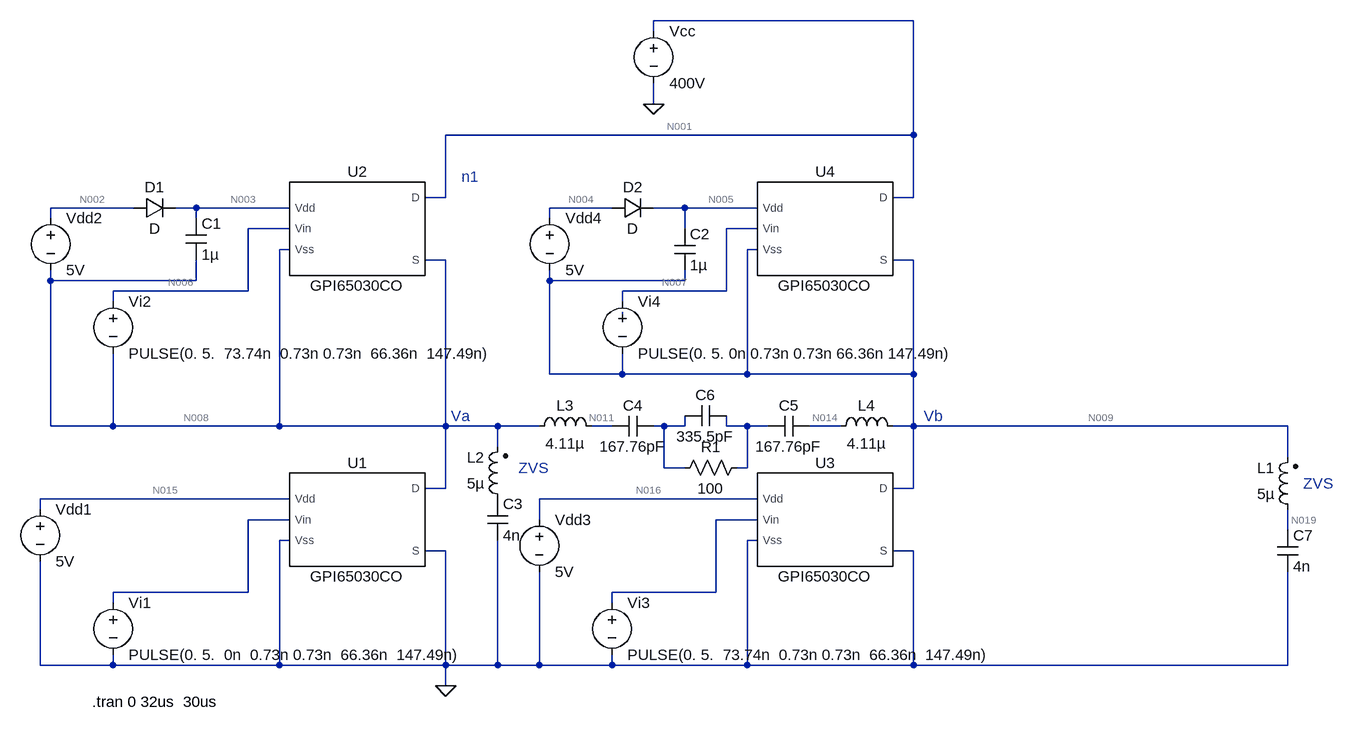
[diagram p0: schematic PowerFull.asc]
PowerFull.asc, the LTspice schematic file:
Version 4
SHEET 1 1984 680
WIRE 768 -608 368 -608
WIRE 368 -592 368 -608
WIRE 368 -480 368 -512
WIRE 768 -432 768 -608
WIRE 768 -432 48 -432
WIRE 48 -336 48 -432
WIRE 48 -336 16 -336
WIRE 768 -336 768 -432
WIRE 768 -336 736 -336
WIRE -432 -320 -560 -320
WIRE -336 -320 -368 -320
WIRE -192 -320 -336 -320
WIRE 304 -320 208 -320
WIRE 416 -320 368 -320
WIRE 528 -320 416 -320
WIRE -560 -304 -560 -320
WIRE -336 -304 -336 -320
WIRE 208 -304 208 -320
WIRE -192 -288 -256 -288
WIRE 416 -288 416 -320
WIRE 528 -288 480 -288
WIRE -192 -256 -208 -256
WIRE 528 -256 512 -256
WIRE 48 -240 16 -240
WIRE 768 -240 736 -240
WIRE -560 -208 -560 -224
WIRE -336 -208 -336 -240
WIRE -336 -208 -560 -208
WIRE 208 -208 208 -224
WIRE 416 -208 416 -224
WIRE 416 -208 208 -208
WIRE -256 -192 -256 -288
WIRE -256 -192 -464 -192
WIRE 480 -192 480 -288
WIRE 480 -192 320 -192
WIRE -464 -176 -464 -192
WIRE 320 -176 320 -192
WIRE 320 -144 320 -160
WIRE 208 -64 208 -208
WIRE 320 -64 320 -96
WIRE 320 -64 208 -64
WIRE 512 -64 512 -256
WIRE 512 -64 320 -64
WIRE 768 -64 768 -240
WIRE 768 -64 512 -64
WIRE -560 16 -560 -208
WIRE -464 16 -464 -96
WIRE -464 16 -560 16
WIRE -208 16 -208 -256
WIRE -208 16 -464 16
WIRE 48 16 48 -240
WIRE 48 16 -208 16
WIRE 128 16 48 16
WIRE 192 16 128 16
WIRE 304 16 272 16
WIRE 384 16 368 16
WIRE 416 16 416 0
WIRE 416 16 384 16
WIRE 480 16 480 0
WIRE 512 16 480 16
WIRE 544 16 512 16
WIRE 656 16 608 16
WIRE 768 16 768 -64
WIRE 768 16 736 16
WIRE 1344 16 768 16
WIRE 128 48 128 16
WIRE 1344 64 1344 16
WIRE 384 80 384 16
WIRE 416 80 384 80
WIRE 512 80 512 16
WIRE 512 80 496 80
WIRE 48 112 48 16
WIRE 48 112 16 112
WIRE 768 112 768 16
WIRE 768 112 736 112
WIRE -192 128 -576 128
WIRE 528 128 192 128
WIRE -576 144 -576 128
WIRE -192 160 -256 160
WIRE 192 160 192 128
WIRE 528 160 464 160
WIRE 1344 176 1344 144
WIRE -192 192 -208 192
WIRE 528 192 512 192
WIRE 48 208 16 208
WIRE 768 208 736 208
WIRE -256 272 -256 160
WIRE -256 272 -464 272
WIRE 464 272 464 160
WIRE 464 272 304 272
WIRE -464 288 -464 272
WIRE 304 288 304 272
WIRE -576 384 -576 224
WIRE -464 384 -464 368
WIRE -464 384 -576 384
WIRE -208 384 -208 192
WIRE -208 384 -464 384
WIRE 48 384 48 208
WIRE 48 384 -208 384
WIRE 128 384 128 192
WIRE 128 384 48 384
WIRE 192 384 192 240
WIRE 192 384 128 384
WIRE 304 384 304 368
WIRE 304 384 192 384
WIRE 512 384 512 192
WIRE 512 384 304 384
WIRE 768 384 768 208
WIRE 768 384 512 384
WIRE 1344 384 1344 240
WIRE 1344 384 768 384
WIRE 48 416 48 384
FLAG 48 416 0
FLAG 368 -480 0
SYMBOL voltage -464 272 R0
WINDOW 123 0 0 Left 2
WINDOW 39 0 0 Left 2
SYMATTR InstName Vi1
SYMATTR Value PULSE(0. 5.  0n  0.73n 0.73n  66.36n  147.49n)
SYMBOL voltage -464 -192 R0
WINDOW 123 0 0 Left 2
WINDOW 39 0 0 Left 2
SYMATTR InstName Vi2
SYMATTR Value PULSE(0. 5.  73.74n  0.73n 0.73n  66.36n  147.49n)
SYMBOL voltage -576 128 R0
WINDOW 123 0 0 Left 2
WINDOW 39 9 129 Left 2
SYMATTR InstName Vdd1
SYMATTR Value 5V
SYMBOL voltage 304 272 R0
WINDOW 123 0 0 Left 2
WINDOW 39 0 0 Left 2
SYMATTR InstName Vi3
SYMATTR Value PULSE(0. 5.  73.74n  0.73n 0.73n  66.36n  147.49n)
SYMBOL voltage 320 -192 R0
WINDOW 123 0 0 Left 2
WINDOW 39 0 0 Left 2
SYMATTR InstName Vi4
SYMATTR Value PULSE(0. 5. 0n 0.73n 0.73n 66.36n 147.49n)
SYMBOL ind2 1360 160 R180
WINDOW 0 36 80 Left 2
WINDOW 3 36 40 Left 2
SYMATTR InstName L1
SYMATTR Value 5µ
SYMATTR Type ind
SYMBOL cap 1328 176 R0
SYMATTR InstName C7
SYMATTR Value 4n
SYMBOL ind2 144 144 R180
WINDOW 0 36 80 Left 2
WINDOW 3 36 40 Left 2
SYMATTR InstName L2
SYMATTR Value 5µ
SYMATTR Type ind
SYMBOL cap 112 128 R0
SYMATTR InstName C3
SYMATTR Value 4n
SYMBOL ind 176 32 R270
WINDOW 0 32 56 VTop 2
WINDOW 3 5 56 VBottom 2
SYMATTR InstName L3
SYMATTR Value 4.11µ
SYMBOL cap 368 0 R90
WINDOW 0 0 32 VBottom 2
WINDOW 3 32 32 VTop 2
SYMATTR InstName C4
SYMATTR Value 167.76pF
SYMBOL cap 608 0 R90
WINDOW 0 0 32 VBottom 2
WINDOW 3 32 32 VTop 2
SYMATTR InstName C5
SYMATTR Value 167.76pF
SYMBOL ind 640 32 R270
WINDOW 0 32 56 VTop 2
WINDOW 3 5 56 VBottom 2
SYMATTR InstName L4
SYMATTR Value 4.11µ
SYMBOL cap 480 -16 R90
WINDOW 0 0 32 VBottom 2
WINDOW 3 32 32 VTop 2
SYMATTR InstName C6
SYMATTR Value 335.5pF
SYMBOL GPI65030CO -96 160 R0
SYMATTR InstName U1
SYMBOL GPI65030CO -96 -288 R0
SYMATTR InstName U2
SYMBOL GPI65030CO 624 160 R0
SYMATTR InstName U3
SYMBOL voltage -560 -320 R0
WINDOW 123 0 0 Left 2
WINDOW 39 9 129 Left 2
SYMATTR InstName Vdd2
SYMATTR Value 5V
SYMBOL voltage 192 144 R0
WINDOW 123 0 0 Left 2
WINDOW 39 9 129 Left 2
SYMATTR InstName Vdd3
SYMATTR Value 5V
SYMBOL voltage 208 -320 R0
WINDOW 123 0 0 Left 2
WINDOW 39 9 129 Left 2
SYMATTR InstName Vdd4
SYMATTR Value 5V
SYMBOL cap 400 -288 R0
SYMATTR InstName C2
SYMATTR Value 1µ
SYMBOL cap -352 -304 R0
SYMATTR InstName C1
SYMATTR Value 1µ
SYMBOL voltage 368 -608 R0
WINDOW 123 0 0 Left 2
WINDOW 39 9 129 Left 2
SYMATTR InstName Vcc
SYMATTR Value 400V
SYMBOL GPI65030CO 624 -288 R0
SYMATTR InstName U4
SYMBOL diode 304 -304 R270
WINDOW 0 32 32 VTop 2
WINDOW 3 0 32 VBottom 2
SYMATTR InstName D2
SYMBOL diode -432 -304 R270
WINDOW 0 32 32 VTop 2
WINDOW 3 0 32 VBottom 2
SYMATTR InstName D1
SYMBOL res 512 64 R90
WINDOW 0 0 56 VBottom 2
WINDOW 3 32 56 VTop 2
SYMATTR InstName R1
SYMATTR Value 100
TEXT -496 440 Left 2 !.tran 0 32us  30us
TEXT 72 -368 Left 2 ;n1
TEXT 56 0 Left 2 ;Va
TEXT 160 80 Left 2 ;ZVS
TEXT 1368 104 Left 2 ;ZVS
TEXT 784 0 Left 2 ;Vb

The netlist it stands for:
* PowerFull.asc
Vi1 N017 0 PULSE(0. 5.  0n  0.73n 0.73n  66.36n  147.49n)
Vi2 N006 N008 PULSE(0. 5.  73.74n  0.73n 0.73n  66.36n  147.49n)
Vdd1 N015 0 5V
Vi3 N018 0 PULSE(0. 5.  73.74n  0.73n 0.73n  66.36n  147.49n)
Vi4 N007 N009 PULSE(0. 5. 0n 0.73n 0.73n 66.36n 147.49n)
L1 N019 N009 5µ
C7 N019 0 4n
L2 P001 N008 5µ
C3 P001 0 4n
L3 N008 N011 4.11µ
C4 N012 N011 167.76pF
C5 N014 N013 167.76pF
L4 N014 N009 4.11µ
C6 N013 N012 335.5pF
XU1 N015 N017 0 N008 0 GPI65030CO  ; pins Vdd Vin Vss D S
XU2 N003 N006 N008 N001 N008 GPI65030CO  ; pins Vdd Vin Vss D S
XU3 N016 N018 0 N009 0 GPI65030CO  ; pins Vdd Vin Vss D S
Vdd2 N002 N008 5V
Vdd3 N016 0 5V
Vdd4 N004 N009 5V
C2 N005 N009 1µ
C1 N003 N008 1µ
Vcc N001 0 400V
XU4 N005 N007 N009 N001 N009 GPI65030CO  ; pins Vdd Vin Vss D S
D2 N004 N005 D
D1 N002 N003 D
R1 N013 N012 100
.model D D
.lib standard.dio
.tran 0 32us  30us
* n1
* Va
* ZVS
* ZVS
* Vb
.lib GPI65030CO.LIB
.backanno
.end

* Results of the author's LTspice run, read from the files saved beside the schematic
* Operating Point, zero values left out:
*   V(n006) = -667.4 mV
*   V(n008) = -667.4 mV
*   V(n015) = 5 V
*   V(n007) = -667.4 mV
*   V(n009) = -667.4 mV
*   V(n019) = -667.4 mV
*   V(p001) = -667.4 mV
*   V(n011) = -667.4 mV
*   V(n014) = -667.4 mV
*   V(n003) = 3.78 V
*   V(n001) = 400 V
*   V(n016) = 5 V
*   V(n002) = 4.333 V
*   V(n004) = 4.333 V
*   V(n005) = 3.78 V
*   I(D1) = 18.9 µA
*   I(D2) = 18.9 µA
*   I(Vcc) = -1.237 nA
*   I(Vdd4) = -18.9 µA
*   I(Vdd3) = -25 µA
*   I(Vdd2) = -18.9 µA
*   I(Vdd1) = -25 µA
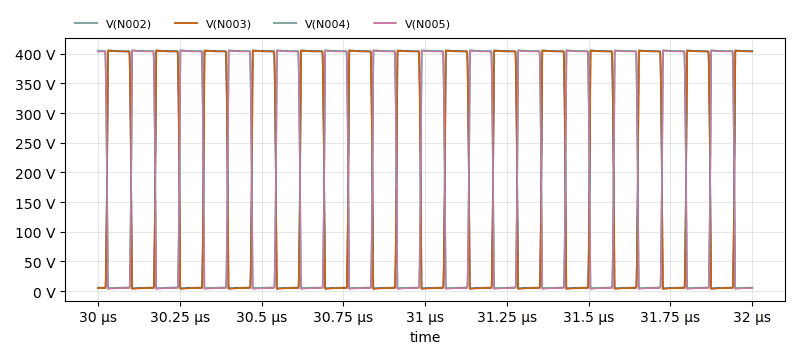
[diagram p1: Transient Analysis of PowerFull.asc, plotted from the saved traces]
* Transient Analysis, 1 run:
*   V(N002): min 4.471 V, max 405.5 V, average 206.3 V, rms 282.7 V, last 404.1 V
*   V(N003): min 3.889 V, max 404.9 V, average 205.7 V, rms 282.3 V, last 403.6 V
*   V(N004): min 4.47 V, max 405.5 V, average 200.8 V, rms 278.7 V, last 5.814 V
*   V(N005): min 3.889 V, max 404.9 V, average 200.2 V, rms 278.3 V, last 5.23 V